# EAGLE design Stepper Motor Control PIC16F84A.REV1.A (EAGLE 5.11)
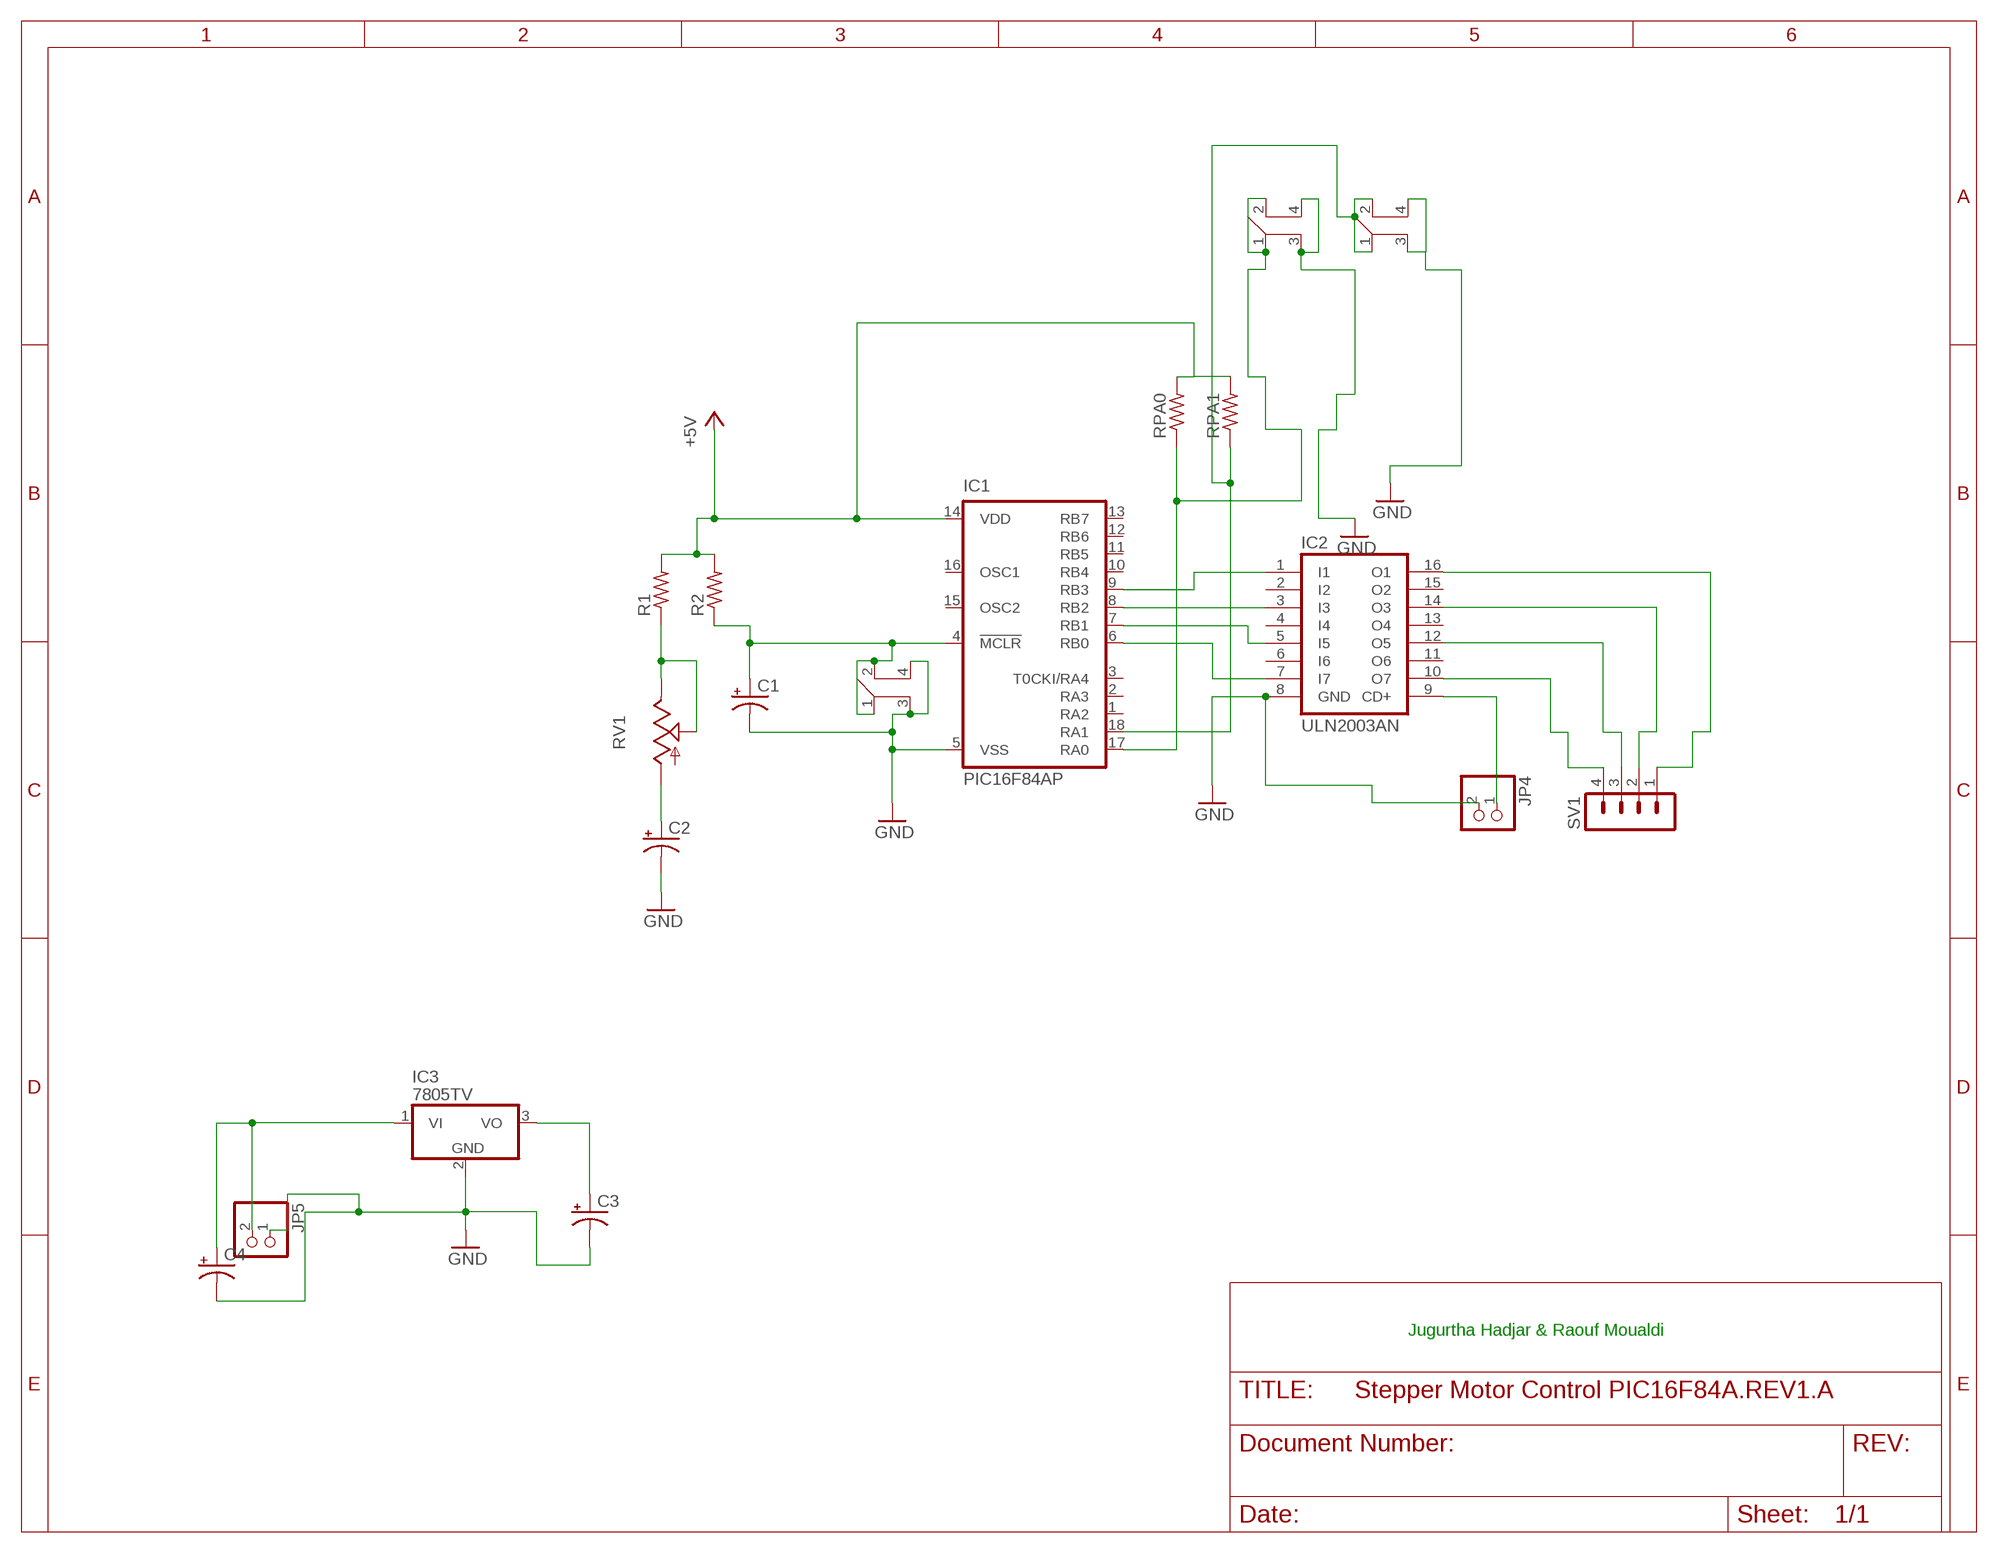
[diagram p0: schematic, sheet 1]

## Parts
C1  CPOL-USE2.5-5  [E2,5-5]
C2  CPOL-USE2.5-5  [E2,5-5]
C3  CPOL-USE5-5  [E5-5]
C4  CPOL-USTAP5-50  [TAP5-50]
IC1  PIC16F84AP  [DIL18]
IC2  ULN2003AN  [DIL16]
IC3  7805TV  [TO220V]
JP1  JUG_PUSHJUG_PUSH_3*2  [JUG_PUSH]
JP2  JUG_PUSHJUG_PUSH_3*2  [JUG_PUSH]
JP3  JUG_PUSHJUG_PUSH_3*2  [JUG_PUSH]
JP4  PINHD-1X2  [1X02]
JP5  PINHD-1X2  [1X02]
R1  R-US_0207/10  [0207/10]
R2  R-US_0207/10  [0207/10]
RPA0  R-US_0207/10  [0207/10]
RPA1  R-US_0207/10  [0207/10]
RV1  TRIM_US-CA9V  [CA9V]
SV1  MA04-1  [MA04-1]

## Nets
+5V: C3.+ IC1.14(VDD) IC3.3(VO) R1.2 R2.2 RPA0.2 RPA1.2
GND: C1.- C2.- C3.- C4.- IC1.5(VSS) IC2.8(GND) IC3.2(GND) JP1.3 JP1.4 JP2.3 JP2.4 JP3.3 JP3.4 JP4.2 JP5.1
N$1: IC2.16(O1) SV1.1
N$2: IC2.14(O3) SV1.2
N$3: IC2.10(O7) SV1.4
N$4: IC2.12(O5) SV1.3
N$5: IC1.9(RB3) IC2.1(I1)
N$6: IC1.7(RB1) IC2.5(I5)
N$7: IC1.6(RB0) IC2.7(I7)
N$8: IC1.8(RB2) IC2.3(I3)
N$9: C1.+ IC1.4(!MCLR) JP3.1 JP3.2 R2.1
N$10: IC1.17(RA0) JP2.1 JP2.2 RPA0.1
N$12: R1.1 RV1.E RV1.S
N$13: C2.+ RV1.A
N$14: C4.+ IC3.1(VI) JP5.2
N$15: IC1.18(RA1) JP1.1 JP1.2 RPA1.1
N$17: IC2.9(CD+) JP4.1
Unconnected: IC1.1(RA2) IC1.2(RA3) IC1.3(T0CKI/RA4) IC1.10(RB4) IC1.11(RB5) IC1.12(RB6) IC1.13(RB7) IC1.15(OSC2) IC1.16(OSC1) IC2.2(I2) IC2.4(I4) IC2.6(I6) IC2.11(O6) IC2.13(O4) IC2.15(O2)

## Notes on the sheet
- Jugurtha Hadjar & Raouf Moualdi

## Library data of the parts
C1-C4 = rcl_JUG:CPOL-US: POLARIZED CAPACITOR, American symbol
IC1 = microchip_JUG:PIC16F8*: MICROCONTROLLER 8-Bit PIC16F8X Family - CMOS Flash/EEPROM Pin Compatible : PIC16F83, PIC16CR83, PIC16F84A, PIC16CR84 see also PIC16C* <DEVICE:PIC16C*>; MF: MICROCHIP; MPN: PIC16F84A-04I/P; OC_FARNELL: 9760865; OC_NEWARK: 69K7635
IC2 = uln-udn_JUG:ULN2003A: DRIVER ARRAY
IC3 = linear_JUG:78*: Positive VOLTAGE REGULATOR Source: http://cache.national.com/ds/LM/LM78L05.pdf http://www.fairchildsemi.com/ds/LM/LM7805.pdf
JP1-JP3 = JUG_PUSH:JUG_PUSH: Tactile push button, distance of .20 inch x .25 inch Jugurtha Hadjar
JP4 JP5 = pinhead_JUG:PINHD-1X2: PIN HEADER
R1 R2 RPA0 RPA1 = rcl_JUG:R-US_: RESISTOR, American symbol
RV1 = pot_JUG:TRIM_US-: POTENTIOMETER
SV1 = con-lstb_JUG:MA04-1: PIN HEADER; OC_FARNELL: unknown; OC_NEWARK: unknown

## Board
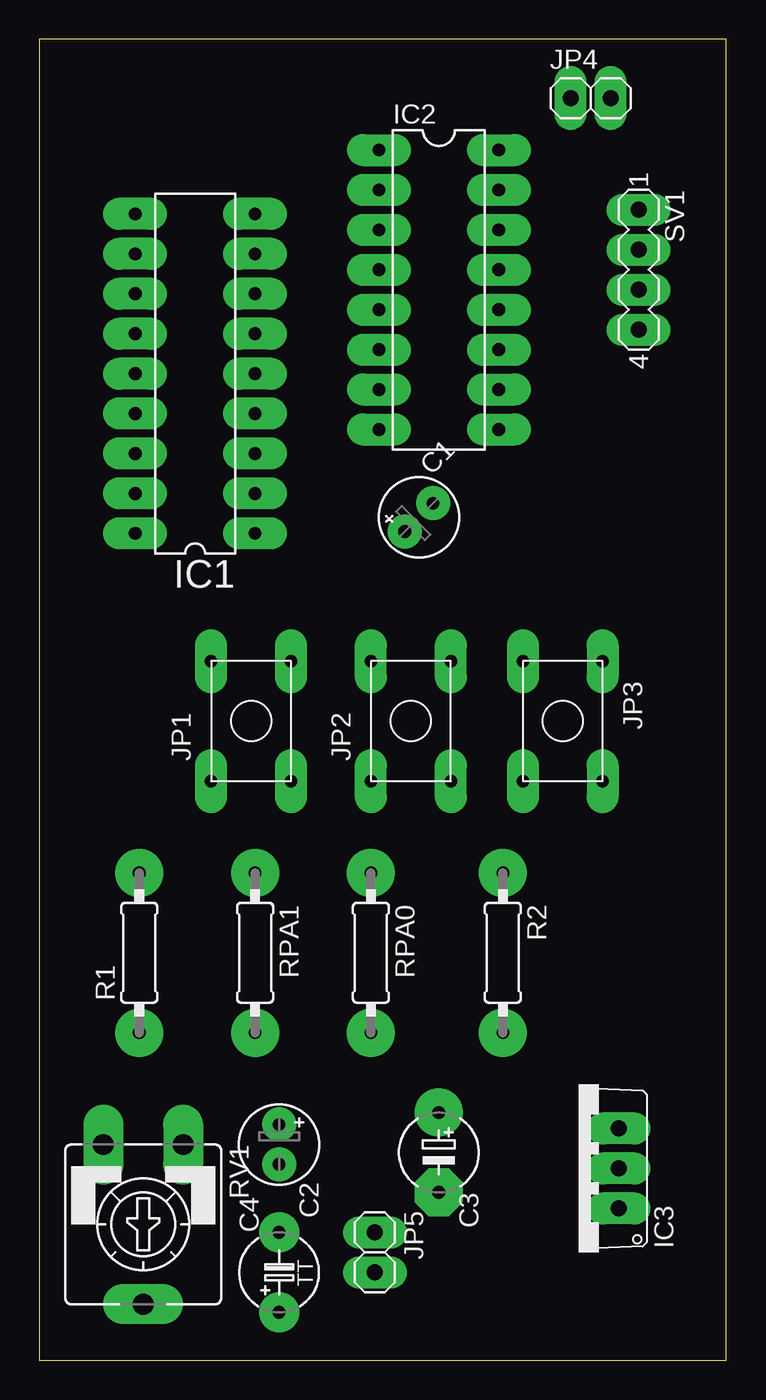
[diagram p1: board, top side]
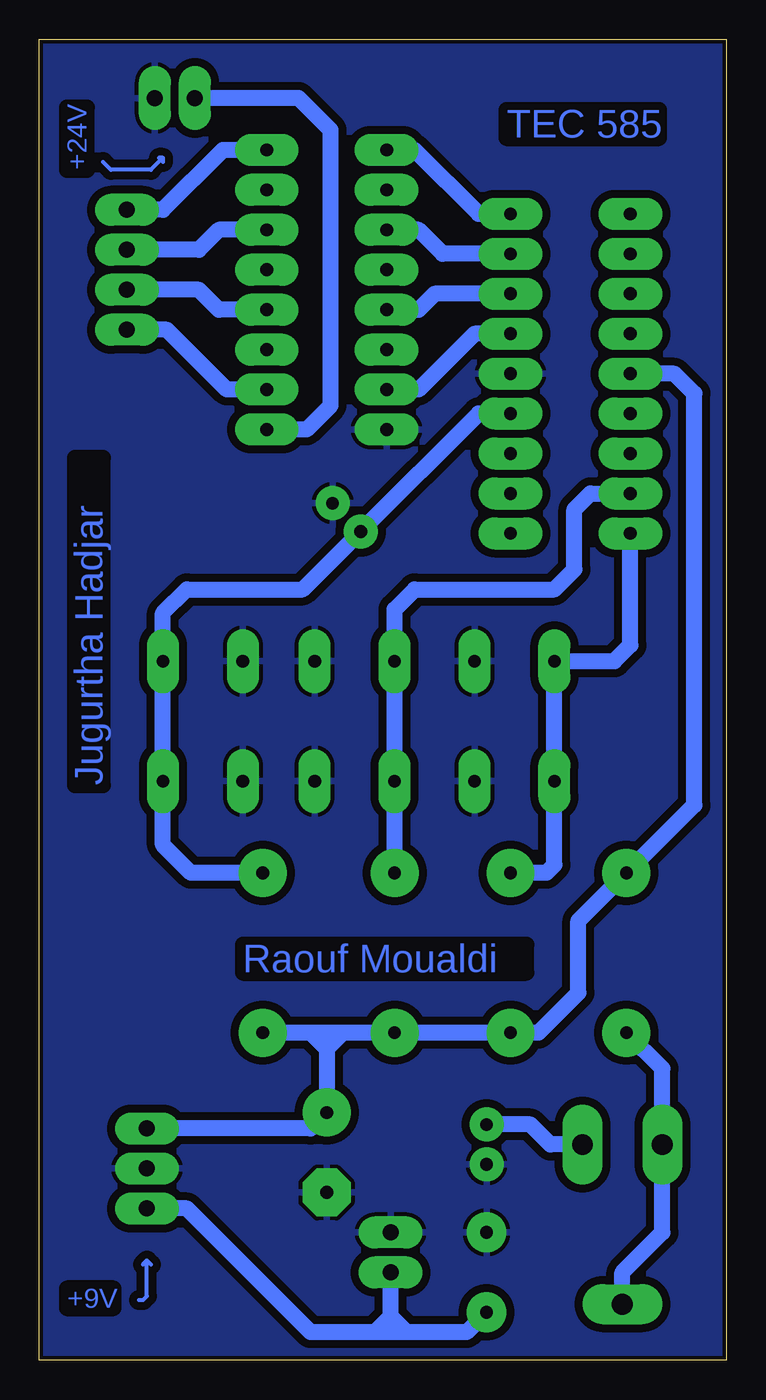
[diagram p2: board, bottom side, seen from below]

Size 43.67 x 84 mm. Coordinates in mm from the lower left corner, seen from the top.
Outline: 0,0 43.67,0 43.67,84 0,84 0,0
Copper layers (1*16): Top 0.035mm / dielectric 1.5mm / Bottom 0.035mm
Design rules "default *": minimum track width 40mil, minimum drill 30mil, track to track 20mil, track to pad 16mil, pad to pad 10mil, via to via 8mil, smd to smd 8mil, copper to edge 10mil, drill to drill 8mil, minimum pad ring 10mil, minimum via ring 8mil, stop-mask expansion 4mil, vias tented up to drill 0mil, thermal gap 10mil
tRestrict: area -4.1,-7.6 to 66,75.4; area -8.4,56.4 to 67.6,90.4
vRestrict: area -7.1,-9.4 to 68.1,75.4; area -14.2,49.3 to 74.7,91.7

### Footprints (pad centres in the part's own frame; a part is rotated, then mirrored left to right if it is on the bottom)
E2,5-5 = drill 0.813 pad 2.159 round: + -1.27,0; - 1.27,0
E5-5 = drill 0.813 pad 3.048 round: + -2.54,0 | drill 0.813 pad 3.048 octagon: - 2.54,0
TAP5-50 = drill 0.813 pad 2.54 round: + -2.54,0; - 2.54,0
DIL18 = drill 0.813 pad 2.032 long: 1 -10.16,-3.81; 2 -7.62,-3.81; 3 -5.08,-3.81; 4 -2.54,-3.81; 5 0,-3.81; 6 2.54,-3.81; 7 5.08,-3.81; 8 7.62,-3.81; 9 10.16,-3.81; 10 10.16,3.81; 11 7.62,3.81; 12 5.08,3.81; 13 2.54,3.81; 14 0,3.81; 15 -2.54,3.81; 16 -5.08,3.81; 17 -7.62,3.81; 18 -10.16,3.81
DIL16 = drill 0.813 pad 2.032 long: 1 -8.89,-3.81; 2 -6.35,-3.81; 3 -3.81,-3.81; 4 -1.27,-3.81; 5 1.27,-3.81; 6 3.81,-3.81; 7 6.35,-3.81; 8 8.89,-3.81; 9 8.89,3.81; 10 6.35,3.81; 11 3.81,3.81; 12 1.27,3.81; 13 -1.27,3.81; 14 -3.81,3.81; 15 -6.35,3.81; 16 -8.89,3.81
TO220V = drill 1.016 pad 2.032 long: 1 -2.54,-2.54; 2 0,-2.54; 3 2.54,-2.54
JUG_PUSH = drill 0.8 pad 2.032 long: 1 -3.81,2.54; 2 3.81,2.54; 3 -3.81,-2.54; 4 3.81,-2.54
1X02 = drill 1.016 pad 2.032 long: 1 -1.27,0; 2 1.27,0
0207/10 = drill 0.8 pad 3.048 round: 1 -5.08,0; 2 5.08,0
CA9V = drill 1.321 pad 2.54 long: A -2.54,-5.08; E 2.54,-5.08; S 0,5.08
MA04-1 = drill 1.016 pad 2.032 long: 1 -3.81,0; 2 -1.27,0; 3 1.27,0; 4 3.81,0

### Placement (x,y rotation side)
C1  24.13,53.59 45 top
C2  15.24,13.72 270 top
C3  25.4,13.21 270 top
C4  15.24,5.59 90 top
IC1  9.91,62.74 90 top
IC2  25.4,68.07 270 top
IC3  34.29,12.19 90 top
JP1  13.46,40.64 90 top
JP2  23.62,40.64 90 top
JP3  33.27,40.64 270 top
JP4  35.05,80.26 0 top
JP5  21.34,6.86 270 top
R1  6.35,25.91 90 top
R2  29.46,25.91 270 top
RPA0  21.08,25.91 270 top
RPA1  13.72,25.91 270 top
RV1  6.6,8.64 180 top
SV1  38.1,69.34 270 top

### Tracks (layer width: path | path; a pad name or v marks a point on that pad's centre or on a via)
+5V
  Bottom 1.016: 24.38,20.83 RPA0.2 RPA1.2 11.94,20.83 9.4,23.37 9.4,27.94 R1.2 2.03,35.31 2.03,61.47 3.3,62.74 IC1.14 | 24.38,20.83 26.42,20.83 | 26.42,20.83 R2.2 | 25.4,19.81 C3.+ 26.42,14.73 IC3.3 | 26.42,20.83 25.4,19.81 | 24.38,20.83 25.4,19.81
GND
  pour Bottom: 0,0 58.42,0 58.42,84.84 0,84.84
N$1
  Bottom 1.016: SV1.1 35.81,73.15 32,76.96 IC2.16
N$2
  Bottom 1.016: SV1.2 33.53,70.61 32.26,71.88 IC2.14
N$3
  Bottom 1.016: IC2.10 31.75,61.72 35.56,65.53 SV1.4
N$4
  Bottom 1.016: SV1.3 33.53,68.07 32.26,66.8 IC2.12
N$5
  Bottom 1.016: IC1.9 15.75,72.9 19.81,76.96 IC2.1
N$6
  Bottom 1.016: IC2.5 19.56,66.8 18.54,67.82 IC1.7
N$7
  Bottom 1.016: 20.83,61.72 IC2.7 19.56,61.72 16,65.28 IC1.6
N$8
  Bottom 1.016: IC2.3 19.56,71.88 18.03,70.36 IC1.8
N$9
  Bottom 1.016: IC1.4 15.75,60.2 23.23,52.71 C1.+ 23.25,52.7 26.92,49.02 34.29,49.02 35.81,47.5 JP3.1 JP3.2 35.81,32.77 34.04,30.99 R2.1
N$10
  Bottom 1.016: IC1.17 8.64,55.12 9.65,54.1 9.65,50.29 10.92,49.02 19.81,49.02 21.08,47.75 JP2.2 JP2.1 RPA0.1
N$12
  Bottom 1.016: RV1.S 6.6,5.59 4.06,8.13 RV1.E 4.06,18.54 R1.1
N$13
  Bottom 1.016: C2.+ 12.45,14.99 11.18,13.72 RV1.A
N$14
  Bottom 1.016: IC3.1 34.29,9.65 26.42,1.78 22.35,1.78 | C4.+ 16.51,1.78 20.32,1.78 | 20.32,1.78 21.34,1.78 | 21.34,1.78 22.35,1.78 | 21.34,1.78 21.34,2.79 | 21.34,2.79 JP5.2 | 20.32,1.78 21.34,2.79 | 21.34,2.79 22.35,1.78
N$15
  Bottom 1.016: IC1.18 6.1,45.47 7.11,44.45 JP1.2 JP1.1 10.92,31.5 11.43,30.99 RPA1.1
N$17
  Bottom 1.016: IC2.9 26.67,59.18 25.15,60.71 25.15,78.23 27.18,80.26 JP4.1
N$19
  Bottom 0.254: 36.83,6.35 36.58,6.1 | 36.83,6.35 37.08,6.1 | 36.83,6.35 36.83,4.06 37.08,3.81 37.34,3.81
N$22
  Bottom 0.254: 35.81,76.45 36.58,75.69 39.12,75.69 39.62,76.2 | 35.81,76.45 35.81,76.2 | 35.81,76.45 36.07,76.45

### Text on the board
Bottom: TEC 585 | +24V | Jugurtha Hadjar | Raouf Moualdi | +9V